# Altium schematic sheet ASA.SchDoc
size A3; SheetNumber: 1; SheetTotal: 1
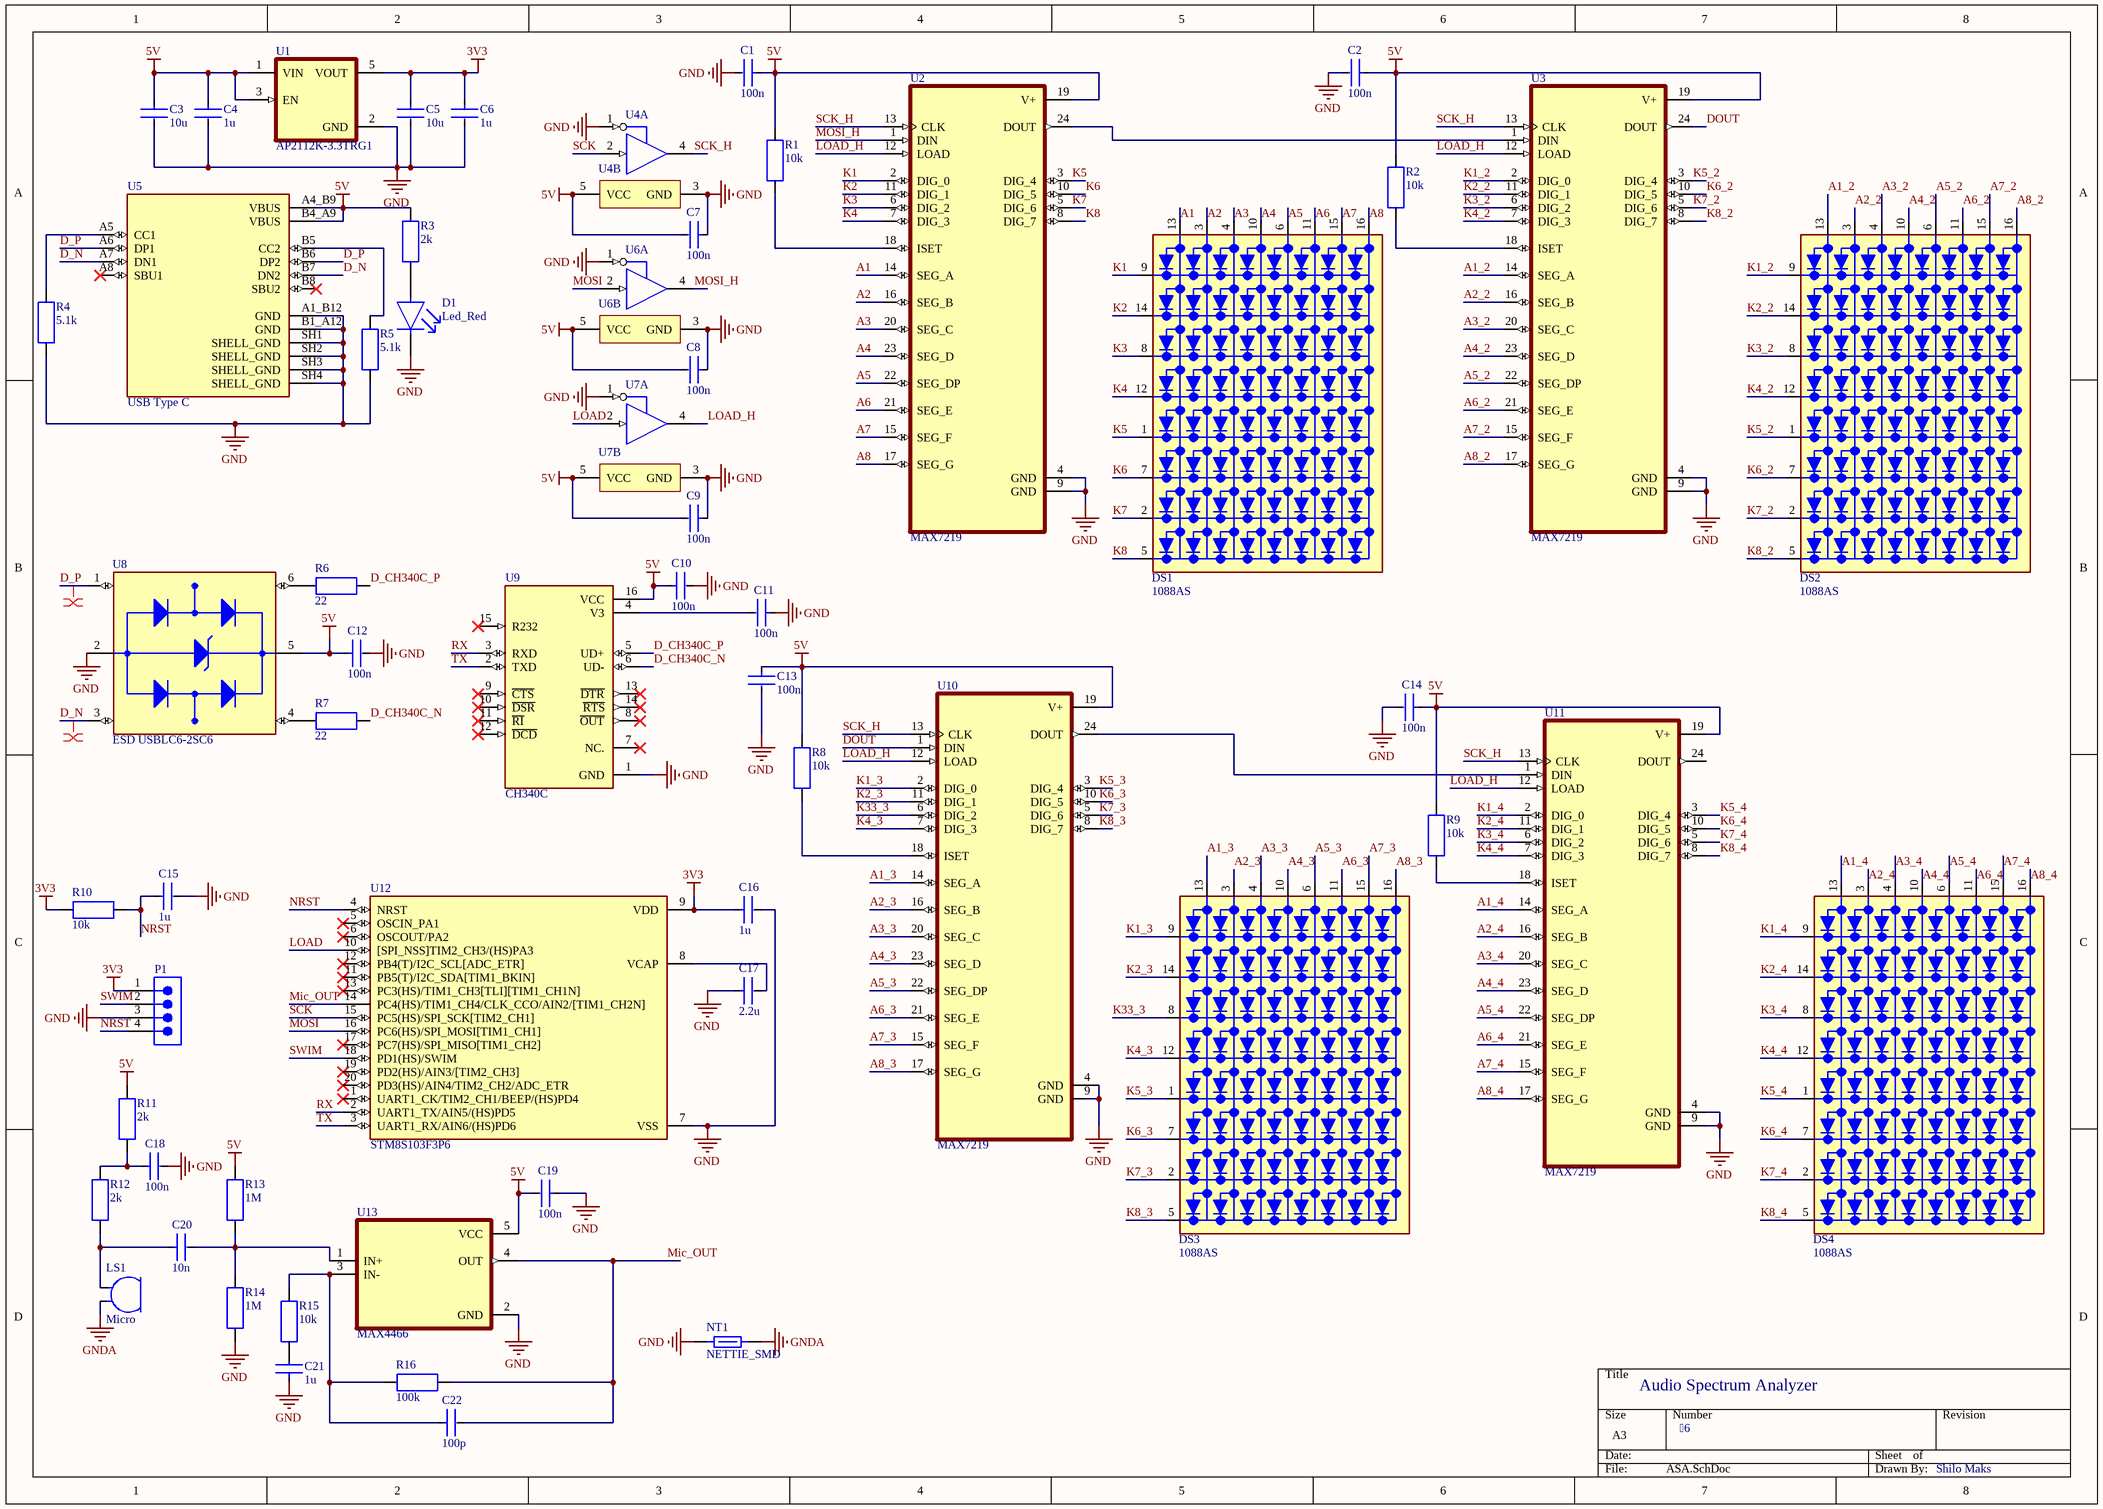
[diagram p0: ASA.SchDoc]

## Parts
C1  value 100n  [Cap_1206]  (hidden comment: Cap_1206)
C2  value 100n  [Cap_1206]  (hidden comment: Cap_1206)
C3  value 10u  [Cap_1206]  (hidden comment: Cap_1206)
C4  value 1u  [Cap_1206]  (hidden comment: Cap_1206)
C5  value 10u  [Cap_1206]  (hidden comment: Cap_1206)
C6  value 1u  [Cap_1206]  (hidden comment: Cap_1206)
C7  value 100n  [Cap_1206]  (hidden comment: Cap_1206)
C8  value 100n  [Cap_1206]  (hidden comment: Cap_1206)
C9  value 100n  [Cap_1206]  (hidden comment: Cap_1206)
C10  value 100n  [Cap_1206]  (hidden comment: Cap_1206)
C11  value 100n  [Cap_1206]  (hidden comment: Cap_1206)
C12  value 100n  [Cap_1206]  (hidden comment: Cap_1206)
C13  value 100n  [Cap_1206]  (hidden comment: Cap_1206)
C14  value 100n  [Cap_1206]  (hidden comment: Cap_1206)
C15  value 1u  [Cap_1206]  (hidden comment: Cap_1206)
C16  1u  [Cap_1206]
C17  value 2.2u  [Cap_1206]  (hidden comment: Cap_1206)
C18  value 100n  [Cap_1206]  (hidden comment: Cap_1206)
C19  value 100n  [Cap_1206]  (hidden comment: Cap_1206)
C20  value 10n  [Cap_1206]  (hidden comment: Cap_1206)
C21  value 1u  [Cap_1206]  (hidden comment: Cap_1206)
C22  value 100p  [Cap_1206]  (hidden comment: Cap_1206)
D1  Led_Red  [Led_Red]
DS1  1088AS  [LED_MATRIX_8x8_1088AS]
DS2  1088AS  [LED_MATRIX_8x8_1088AS]
DS3  1088AS  [LED_MATRIX_8x8_1088AS]
DS4  1088AS  [LED_MATRIX_8x8_1088AS]
LS1  Micro  [Micro]
NT1  NETTIE_SMD  [NETTIE_SMD]  (net tie, no BOM)
P1  61300411021  [61300411021]  (value not drawn)
R1  value 10k  [Res_1206]  (hidden comment: Res_1206)
R2  value 10k  [Res_1206]  (hidden comment: Res_1206)
R3  value 2k  [Res_1206]  (hidden comment: Res_1206)
R4  value 5.1k  [Res_1206]  (hidden comment: Res_1206)
R5  value 5.1k  [Res_1206]  (hidden comment: Res_1206)
R6  value 22  [Res_1206]  (hidden comment: Res_1206)
R7  value 22  [Res_1206]  (hidden comment: Res_1206)
R8  value 10k  [Res_1206]  (hidden comment: Res_1206)
R9  value 10k  [Res_1206]  (hidden comment: Res_1206)
R10  value 10k  [Res_1206]  (hidden comment: Res_1206)
R11  value 2k  [Res_1206]  (hidden comment: Res_1206)
R12  value 2k  [Res_1206]  (hidden comment: Res_1206)
R13  value 1M  [Res_1206]  (hidden comment: Res_1206)
R14  value 1M  [Res_1206]  (hidden comment: Res_1206)
R15  value 10k  [Res_1206]  (hidden comment: Res_1206)
R16  value 100k  [Res_1206]  (hidden comment: Res_1206)
U1  AP2112K-3.3TRG1  [AP2112K-3.3TRG1]
U2  MAX7219  [MAX7219]
U3  MAX7219  [MAX7219]
U4  CAHCT1G125QDCKRG4Q  [DCK0005A_M]  (value not drawn)  (parts A,B of 2)
U5  USB Type C  [USB Type C]
U6  CAHCT1G125QDCKRG4Q  [DCK0005A_M]  (value not drawn)  (parts A,B of 2)
U7  CAHCT1G125QDCKRG4Q  [DCK0005A_M]  (value not drawn)  (parts A,B of 2)
U8  ESD USBLC6-2SC6  [ESD USBLC6-2SC6]
U9  CH340C  [CH340C]
U10  MAX7219  [MAX7219]
U11  MAX7219  [MAX7219]
U12  STM8S103F3P6  [STM8S103F3P6]
U13  MAX4466  [MAX4466]

## Nets
3V3: C5.2 C6.2 C16.2 P1.1 R10.2 U1.5(VOUT) U12.9(VDD)
5V: C1.2 C2.2 C3.2 C4.2 C7.1 C8.1 C9.1 C10.2 C12.2 C13.2 C14.2 C19.1 R1.1 R2.1 R3.1 R8.1 R9.1 R11.1 R13.1 U1.1(VIN) U1.3(EN) U2.19(V+) U3.19(V+) U4.5(VCC) U5.A4_B9(VBUS) U5.B4_A9(VBUS) U6.5(VCC) U7.5(VCC) U8.5(VBUS) U9.16(VCC) U10.19(V+) U11.19(V+) U13.5(VCC)
GND: C1.1 C2.1 C3.1 C4.1 C5.1 C6.1 C7.2 C8.2 C9.2 C10.1 C11.2 C12.1 C13.1 C14.1 C15.1 C16.1 C17.2 C18.1 C19.2 C21.2 D1.1(C) NT1.1 P1.3 R4.1 R5.1 R14.2 U1.2(GND) U2.4(GND) U2.9(GND) U3.4(GND) U3.9(GND) U4.1(~{OE}) U4.3(GND) U5.A1_B12(GND) U5.B1_A12(GND) U5.SH1(SHELL_GND) U5.SH2(SHELL_GND) U5.SH3(SHELL_GND) U5.SH4(SHELL_GND) U6.1(~{OE}) U6.3(GND) U7.1(~{OE}) U7.3(GND) U8.2(GND) U9.1(GND) U10.4(GND) U10.9(GND) U11.4(GND) U11.9(GND) U12.7(VSS) U13.2(GND)
GNDA: LS1.2(C) NT1.2
D_CH340C_N: R7.2 U9.6(UD-)
D_CH340C_P: R6.2 U9.5(UD+)
D_N: U5.A7(DN1) U5.B7(DN2) U8.3(I/O2_IN)
D_P: U5.A6(DP1) U5.B6(DP2) U8.1(I/O1_IN)
DOUT: U3.24(DOUT) U10.1(DIN)
K1: DS1.9(CATHODE_ROW_1) U2.2(DIG_0)
K1_2: DS2.9(CATHODE_ROW_1) U3.2(DIG_0)
K1_3: DS3.9(CATHODE_ROW_1) U10.2(DIG_0)
K1_4: DS4.9(CATHODE_ROW_1) U11.2(DIG_0)
K2: DS1.14(CATHODE_ROW_2) U2.11(DIG_1)
K2_2: DS2.14(CATHODE_ROW_2) U3.11(DIG_1)
K2_3: DS3.14(CATHODE_ROW_2) U10.11(DIG_1)
K2_4: DS4.14(CATHODE_ROW_2) U11.11(DIG_1)
K3: DS1.8(CATHODE_ROW_3) U2.6(DIG_2)
K3_2: DS2.8(CATHODE_ROW_3) U3.6(DIG_2)
K3_4: DS4.8(CATHODE_ROW_3) U11.6(DIG_2)
K4: DS1.12(CATHODE_ROW_4) U2.7(DIG_3)
K4_2: DS2.12(CATHODE_ROW_4) U3.7(DIG_3)
K4_3: DS3.12(CATHODE_ROW_4) U10.7(DIG_3)
K4_4: DS4.12(CATHODE_ROW_4) U11.7(DIG_3)
K5: DS1.1(CATHODE_ROW_5) U2.3(DIG_4)
K5_2: DS2.1(CATHODE_ROW_5) U3.3(DIG_4)
K5_3: DS3.1(CATHODE_ROW_5) U10.3(DIG_4)
K5_4: DS4.1(CATHODE_ROW_5) U11.3(DIG_4)
K6: DS1.7(CATHODE_ROW_6) U2.10(DIG_5)
K6_2: DS2.7(CATHODE_ROW_6) U3.10(DIG_5)
K6_3: DS3.7(CATHODE_ROW_6) U10.10(DIG_5)
K6_4: DS4.7(CATHODE_ROW_6) U11.10(DIG_5)
K7: DS1.2(CATHODE_ROW_7) U2.5(DIG_6)
K7_2: DS2.2(CATHODE_ROW_7) U3.5(DIG_6)
K7_3: DS3.2(CATHODE_ROW_7) U10.5(DIG_6)
K7_4: DS4.2(CATHODE_ROW_7) U11.5(DIG_6)
K8: DS1.5(CATHODE_ROW_8) U2.8(DIG_7)
K8_2: DS2.5(CATHODE_ROW_8) U3.8(DIG_7)
K8_3: DS3.5(CATHODE_ROW_8) U10.8(DIG_7)
K8_4: DS4.5(CATHODE_ROW_8) U11.8(DIG_7)
K33_3: DS3.8(CATHODE_ROW_3) U10.6(DIG_2)
LOAD: U7.2(A) U12.10([SPI_NSS]TIM2_CH3/(HS)PA3)
LOAD_H: U2.12(LOAD) U3.12(LOAD) U7.4(Y) U10.12(LOAD) U11.12(LOAD)
Mic_OUT: C22.1 R16.2 U12.14(PC4(HS)/TIM1_CH4/CLK_CCO/AIN2/[TIM1_CH2N]) U13.4(OUT)
MOSI: U6.2(A) U12.16(PC6(HS)/SPI_MOSI[TIM1_CH1])
MOSI_H: U2.1(DIN) U6.4(Y)
NRST: C15.2 P1.4 R10.1 U12.4(NRST)
RX: U9.3(RXD) U12.2(UART1_TX/AIN5/(HS)PD5)
SCK: U4.2(A) U12.15(PC5(HS)/SPI_SCK[TIM2_CH1])
SCK_H: U2.13(CLK) U3.13(CLK) U4.4(Y) U10.13(CLK) U11.13(CLK)
SWIM: P1.2 U12.18(PD1(HS)/SWIM)
TX: U9.2(TXD) U12.3(UART1_RX/AIN6/(HS)PD6)
А1: DS1.13(ANODE_COLUMN_1) U2.14(SEG_A)
А1_2: DS2.13(ANODE_COLUMN_1) U3.14(SEG_A)
А1_3: DS3.13(ANODE_COLUMN_1) U10.14(SEG_A)
А1_4: DS4.13(ANODE_COLUMN_1) U11.14(SEG_A)
А2: DS1.3(ANODE_COLUMN_2) U2.16(SEG_B)
А2_2: DS2.3(ANODE_COLUMN_2) U3.16(SEG_B)
А2_3: DS3.3(ANODE_COLUMN_2) U10.16(SEG_B)
А2_4: DS4.3(ANODE_COLUMN_2) U11.16(SEG_B)
А3: DS1.4(ANODE_COLUMN_3) U2.20(SEG_C)
А3_2: DS2.4(ANODE_COLUMN_3) U3.20(SEG_C)
А3_3: DS3.4(ANODE_COLUMN_3) U10.20(SEG_C)
А3_4: DS4.4(ANODE_COLUMN_3) U11.20(SEG_C)
А4: DS1.10(ANODE_COLUMN_4) U2.23(SEG_D)
А4_2: DS2.10(ANODE_COLUMN_4) U3.23(SEG_D)
А4_3: DS3.10(ANODE_COLUMN_4) U10.23(SEG_D)
А4_4: DS4.10(ANODE_COLUMN_4) U11.23(SEG_D)
А5: DS1.6(ANODE_COLUMN_5) U2.22(SEG_DP)
А5_2: DS2.6(ANODE_COLUMN_5) U3.22(SEG_DP)
А5_3: DS3.6(ANODE_COLUMN_5) U10.22(SEG_DP)
А5_4: DS4.6(ANODE_COLUMN_5) U11.22(SEG_DP)
А6: DS1.11(ANODE_COLUMN_6) U2.21(SEG_E)
А6_2: DS2.11(ANODE_COLUMN_6) U3.21(SEG_E)
А6_3: DS3.11(ANODE_COLUMN_6) U10.21(SEG_E)
А6_4: DS4.11(ANODE_COLUMN_6) U11.21(SEG_E)
А7: DS1.15(ANODE_COLUMN_7) U2.15(SEG_F)
А7_2: DS2.15(ANODE_COLUMN_7) U3.15(SEG_F)
А7_3: DS3.15(ANODE_COLUMN_7) U10.15(SEG_F)
А7_4: DS4.15(ANODE_COLUMN_7) U11.15(SEG_F)
А8: DS1.16(ANODE_COLUMN_8) U2.17(SEG_G)
А8_2: DS2.16(ANODE_COLUMN_8) U3.17(SEG_G)
А8_3: DS3.16(ANODE_COLUMN_8) U10.17(SEG_G)
А8_4: DS4.16(ANODE_COLUMN_8) U11.17(SEG_G)
NetC11_1: C11.1 U9.4(V3)
NetC17_1: C17.1 U12.8(VCAP)
NetC18_2: C18.2 R11.2 R12.1
NetC20_1: C20.1 R13.2 R14.1 U13.1(IN+)
NetC20_2: C20.2 LS1.1(A) R12.2
NetC21_1: C21.1 R15.2
NetC22_2: C22.2 R15.1 R16.1 U13.3(IN-)
NetD1_2: D1.2(A) R3.2
NetR1_2: R1.2 U2.18(ISET)
NetR2_2: R2.2 U3.18(ISET)
NetR4_2: R4.2 U5.A5(CC1)
NetR5_2: R5.2 U5.B5(CC2)
NetR6_1: R6.1 U8.6(I/O1_OUT)
NetR7_1: R7.1 U8.4(I/O2_OUT)
NetR8_2: R8.2 U10.18(ISET)
NetR9_2: R9.2 U11.18(ISET)
NetU2_24: U2.24(DOUT) U3.1(DIN)
NetU10_24: U10.24(DOUT) U11.1(DIN)

Not connected (* = marked no-connect by the designer): U5 A8(SBU1)* B8(SBU2)*; U9 7(NC.)* 8(~{OUT})* 9(~{CTS})* 10(~{DSR})* 11(~{RI})* 12(~{DCD})* 13(~{DTR})* 14(~{RTS})* 15(R232)*; U11 24(DOUT); U12 1(UART1_CK/TIM2_CH1/BEEP/(HS)PD4)* 5(OSCIN_PA1)* 6(OSCOUT/PA2)* 11(PB5(T)/I2C_SDA[TIM1_BKIN])* 12(PB4(T)/I2C_SCL[ADC_ETR])* 13(PC3(HS)/TIM1_CH3[TLI][TIM1_CH1N])* 17(PC7(HS)/SPI_MISO[TIM1_CH2])* 19(PD2(HS)/AIN3/[TIM2_CH3])* 20(PD3(HS)/AIN4/TIM2_CH2/ADC_ETR)*

## Layout directives
differential pair: D_N, D_P

## Notes on the sheet
- Audio Spectrum Analyzer
- 6
- Shilo Maks

## Library data of the parts
C16 = Cap_1206: Value: 1u
P1 = CMP-1502-01063-4: THT Angled Pin Header WR-PHD, Pitch 2.54 mm, Single Row, 4 pins; Current Rating: 3A; Number of Contacts: 4; Gender: Male; Operating Supply Voltage: 250V; Contact Resistance: 20mΩ; Connector Type: Male Pin; Pitch: 2.54mm; Contact Material: Copper; Number of Positions: 4; Color: Black; Contact Plating: Gold; Number of Pins: 4; Termination: Solder; Number of Rows: 1; Lead Pitch: 2.54mm; Mount: Through Hole; Contact Mating Length: 5.9944mm; RoHS: Compliant
U4 U6 U7 = CMP-0859-00347-3: Generic Part Number: SN74AHCT1G125-Q1; Manufacturer: Texas Instruments; F @ Nom Voltage(Max)(Mhz): 75; ICC @ Nom Voltage(Max)(mA): 0.01; Output Drive (IOL/IOH)(Max)(mA): 8/-8; Rating: Automotive; Logic: True; Voltage(Nom)(V): 5; tpd @ Nom Voltage(Max)(ns): 6; VCC(Min)(V): 3; Technology Family: AHCT; 3-State Output: Yes; Bits(#): 1; Sub-Family: Non-Inverting Buffer/Driver; Input Type: CMOS; Schmitt Trigger: No; VCC(Max)(V): 5.5; PackageReference: DCK0005A; DatasheetVersion: SCLS504B; Operating Temperature Range(C): -40 to 125; Output Type: CMOS